# Altium schematic sheet 1_Airframe-Power_1.SchDoc
size A4; SheetNumber: 1; SheetTotal: 2; SPICEModelCacheFLVJDJZP: <root> / <DocumentId>FLVJDJZP</DocumentId> / </root>
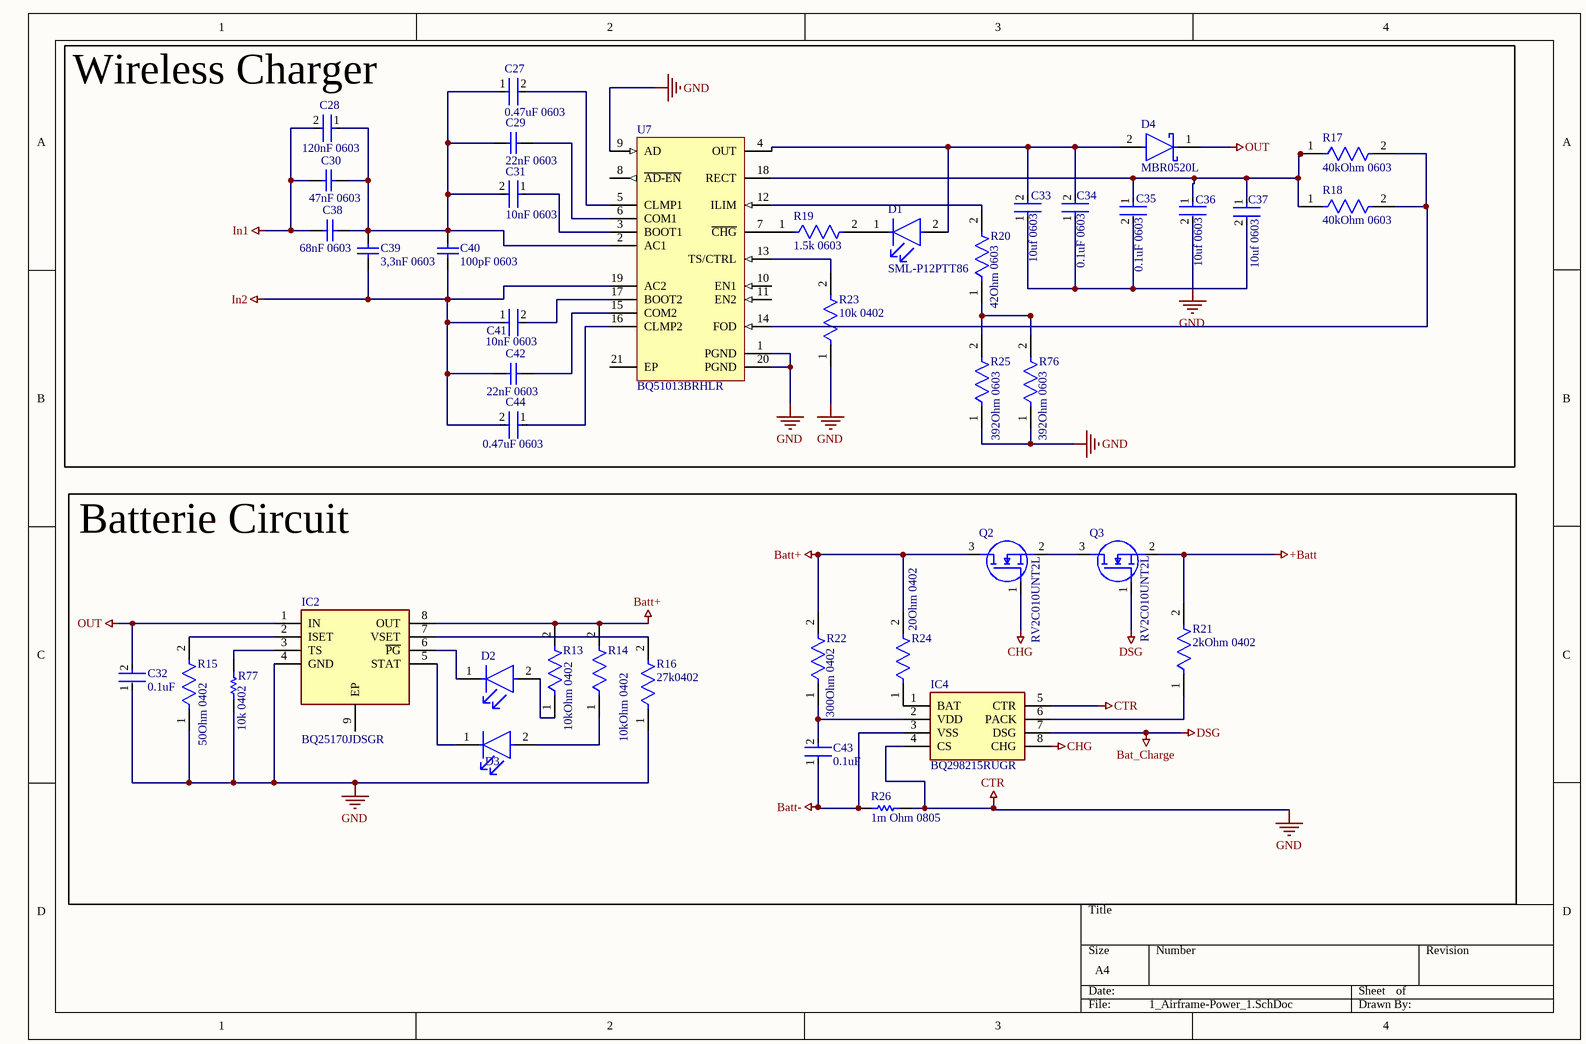
[diagram p0: 1_Airframe-Power_1.SchDoc]

## Parts
C27  0.47uF 0603  [FP-GRM188-0_1-e0_2_0_5-IPC_A]
C28  120nF 0603  [FP-C0603C-CF-MFG]
C29  22nF 0603  [CAPC1608X90X35ML10T15]
C30  47nF 0603  [CAPC1608X90X35ML10T15]
C31  10nF 0603  [FP-CC0603-DA-MFG]
C32  0.1uF  [FP-GRM15-MFG]
C33  10uf 0603  [FP-GRM188-0_1-e0_2_0_55-IPC_C]
C34  0.1uF 0603  [FP-C0603C-CF-MFG]
C35  0.1uF 0603  [FP-C0603C-CF-MFG]
C36  10uf 0603  [FP-GRM188-0_1-e0_2_0_55-IPC_C]
C37  10uf 0603  [FP-GRM188-0_1-e0_2_0_55-IPC_C]
C38  68nF 0603  [CAPC1608X90X35LL10T15]
C39  3,3nF 0603  [CAPC1608X90X35LL10T15]
C40  100pF 0603  [CAPC1608X90X35NL10T15]
C41  10nF 0603  [FP-CC0603-DA-MFG]
C42  22nF 0603  [CAPC1608X90X35ML10T15]
C43  0.1uF  [FP-GRM15-MFG]
C44  0.47uF 0603  [FP-GRM188-0_1-e0_2_0_5-IPC_A]
D1  SML-P12PTT86  [FP-SML-P1-MFG]
D2  SML-P12PTT86  [FP-SML-P1-MFG]  (value not drawn)
D3  SML-P12PTT86  [FP-SML-P1-MFG]  (value not drawn)
D4  MBR0520L  [FP-MA02A-MFG]
IC2  BQ25170JDSGR  [SON50P200X200X80-9N]
IC4  BQ298215RUGR  [BQ298215RUGR]
Q2  RV2C010UNT2L  [RV2C010UNT2L]
Q3  RV2C010UNT2L  [RV2C010UNT2L]
R13  10kOhm 0402  [FP-CRCW0402-e3-IPC_C]
R14  10kOhm 0402  [FP-CRCW0402-e3-IPC_C]
R15  50Ohm 0402  [FP-CRCW0402-e3-IPC_C]
R16  27k0402  [FP-CRCW0402-e3-IPC_C]
R17  40kOhm 0603  [FP-CRCW0402-e3-IPC_C]
R18  40kOhm 0603  [FP-CRCW0402-e3-IPC_C]
R19  1.5k 0603  [FP-CRCW0402-e3-IPC_C]
R20  42Ohm 0603  [FP-CRCW0402-e3-IPC_C]
R21  2kOhm 0402  [FP-CRCW0402-e3-IPC_C]
R22  300Ohm 0402  [FP-CRCW0402-e3-IPC_C]
R23  10k 0402  [FP-CRCW0402-e3-IPC_B]
R24  20Ohm 0402  [FP-CRCW0402-e3-IPC_C]
R25  392Ohm 0603  [FP-CRCW0402-e3-IPC_C]
R26  1m Ohm 0805  [RESC1609X50X30LL10T20]
R76  392Ohm 0603  [FP-CRCW0402-e3-IPC_C]
R77  10k 0402  [RESC1608X55X25ML10T15]
U7  BQ51013BRHLR  [RHL0020A_V]

## Blocks framed on the sheet
Wireless Charger: C27-C31 C33-C42 C44 D1 D4 R17-R20 R23 R25 R76 U7
Batterie Circuit: C32 C43 D2 D3 IC2 IC4 Q2 Q3 R13-R16 R21 R22 R24 R26 R77

## Nets
+Batt: Q3.2(S) R21.2
Bat_Charge: IC4.7(DSG) Q3.1(G)  [also labelled DSG]
Batt+: IC2.8(OUT) Q2.3(D) R13.2 R14.2 R22.2 R24.2
Batt-: C43.1 IC4.3(VSS) R26.1
CHG: IC4.8(CHG) Q2.1(G)
CTR: C32.1 C36.2 IC2.4(GND) IC4.4(CS) IC4.5(CTR) R15.1 R16.1 R23.1 R25.1 R26.2 R76.1 R77.2 U7.1(PGND) U7.9(AD) U7.20(PGND)  [also labelled GND]
In1: C28.2 C30.1 C38.1
In2: C39.1 C40.1 C41.1 C42.2 C44.2 U7.19(AC2)
OUT: C32.2 D4.1(C) IC2.1(IN)
NetC27_1: C27.1 C28.1 C29.1 C30.2 C31.2 C38.2 C39.2 C40.2 U7.2(AC1)
NetC27_2: C27.2 U7.5(CLMP1)
NetC29_2: C29.2 U7.6(COM1)
NetC31_1: C31.1 U7.3(BOOT1)
NetC33_1: C33.1 C34.1 C35.2 C37.2
NetC33_2: C33.2 C34.2 D1.2(A) D4.2(A) U7.4(OUT)
NetC35_1: C35.1 C36.1 C37.1 R17.1 R18.1 U7.18(RECT)
NetC41_2: C41.2 U7.17(BOOT2)
NetC42_1: C42.1 U7.15(COM2)
NetC43_2: C43.2 IC4.2(VDD) R22.1
NetC44_1: C44.1 U7.16(CLMP2)
NetD1_1: D1.1(C) R19.2
NetD2_1: D2.1(C) IC2.6(~{PG})
NetD2_2: D2.2(A) R13.1
NetD3_1: D3.1(C) IC2.5(STAT)
NetD3_2: D3.2(A) R14.1
NetIC2_2: IC2.2(ISET) R15.2
NetIC2_3: IC2.3(TS) R77.1
NetIC2_7: IC2.7(VSET) R16.2
NetIC4_1: IC4.1(BAT) R24.1
NetIC4_6: IC4.6(PACK) R21.1
NetQ2_2: Q2.2(S) Q3.3(D)
NetR17_2: R17.2 R18.2 U7.14(FOD)
NetR19_1: R19.1 U7.7(~{CHG})
NetR20_1: R20.1 R25.2 R76.2
NetR20_2: R20.2 U7.12(ILIM)
NetR23_2: R23.2 U7.13(TS/CTRL)

Not connected (* = marked no-connect by the designer): IC2 9(EP); U7 8(~{AD-EN}) 10(EN1) 11(EN2) 21(EP)

## Library data of the parts
C27 C44 = CMP-2006-02860-2: Chip Multilayer Ceramic Capacitors for General Purpose, 0603, 0.47uF, X7R, 15%, 10%, 16V; Capacitance: 470nF; Material: Ceramic; Termination: SMD/SMT; Case Code (Imperial): 0603; Height: 0.8mm; Dielectric: X7R; Length: 1.6mm; Packaging: Tape and Reel; Mount: Surface Mount; Thickness: 0.035inch; Voltage Rating (DC): 16V; Case Code (Metric): 1608; REACH SVHC: No SVHC; Depth: 0.8mm; Number of Pins: 2; Max Operating Temperature: 125°C; Min Operating Temperature: -55°C; Width: 0.8mm; Voltage: 16V; Lead Free: Lead Free; Voltage Rating: 16V; Package Quantity: 1; Case/Package: 0603; Tolerance: 10%
C28 = CMP-1035-02605-3: 0603 C 120nF Ceramic Multilayer Capacitor; 50 V; +125degC; X7R Dielec; +/-10%; Manufacturer: KEMET; Manufacturer Part Number: C0603C124K5RACTU; Capacitance: 0.12 μF; Automotive Grade: Grade 1; Voltage Rating: 50 V; Tolerance: 0.1; Temperature Coefficient: 30ppm/°C; Value: 0.12 μF; Device Class L2: Capacitors; Package: C0603C-CF; Digikey Description: 0603 C 120nF Ceramic Multilayer Capacitor; 50 V; +125degC; X7R Dielec; +/-10%; Device Class L3: Ceramic Capacitors; Category: Cap; Material: Ceramic; Height: 0.87mm; Temperature: -55°C to +125°C; Temperature Range High: +125°C; Temperature Characteristic: X7R; Lead Free: Yes; Automotive: Yes; ComponentLink2URL: https://api.kemet.com/component-edge/download/datasheet/C0603C100J5GACAUTO.pdf; Octopart: https://octopart.com/c0603c124k5ractu-kemet-12818104; Device Class L1: Passive Components; RoHS: TRUE; ComponentLink2Description: Datasheet; Temperature Range Low: -55°C
C29 C42 = CMP-2006-02910-1: Manufacturer: Murata; Part Number: GRM188R71H223KA01D
C30 = CMP-2006-02927-1: Manufacturer: Murata; Part Number: GRM188R71H473KA61D
C31 C41 = CMP-2100-03600-2: CAP CER 10000PF 50V X7R 0603; Manufacturer Part Number: CC0603KRX7R9BB103; Manufacturer: YAGEO; Tolerance: 0.1; Material: Ceramic; Temperature Coefficient: 15%; Mouser Description: Multilayer Ceramic Capacitor, CC Series, 0.01 - F, - 10%, X7R, 50 V, 0603 [1608 Metric]; Digikey Description: CAP CER 10000PF 50V X7R 0603; Height: 0.9mm; Category: Cap; Temperature Characteristic: X7R; Footprint Url: http://www.yageo.com/exep/pages/download/literatures/UPY-C_GEN_24.pdf; Lead Free: Yes; Voltage Rating: 50 V; Temperature: -55°C to +125°C; Device Class L3: Ceramic Capacitors; ComponentLink2Description: Datasheet; Voltage: 50 V; Package: CC0603-DA; Octopart: https://octopart.com/cc0603krx7r9bb103-yageo-192938; Automotive: No; Temperature Range High: +125°C; Temperature Range Low: -55°C; Value: 10 nF; RoHS: TRUE; Device Class L1: Passive Components; ComponentLink2URL: http://www.yageo.com/documents/recent/UPY-GPHC_X7R_6.3V-to-50V_18.pdf; Device Class L2: Capacitors; Capacitance: 10 nF
C32 C43 = CMP-2100-03641-2: CAP CER 0.1UF 16V X7R 0402; Manufacturer Part Number: GRM155R71C104KA88D; Manufacturer: Murata; Standoff Height: 0mm; Tolerance: 10%; Voltage Rating: 16Vdc; Material: Ceramic; Capacitance: 0.10μF; Value: 0.10μF; RoHS: TRUE; Temperature Characteristic: X7R; Octopart: https://octopart.com/grm155r71c104ka88d-murata-196880; Digikey Description: CAP CER 0.1UF 16V X7R 0402; Device Class L3: Ceramic Capacitors; Height: 0.55mm; ComponentLink2Description: Datasheet; Temperature Range Low: -55°C; Ipc Land Pattern Name: CAPC10050X219; ComponentLink2URL: https://search.murata.co.jp/Ceramy/image/img/A01X/G101/ENG/GRM155R71H471KA01-01A.pdf; Device Class L1: Passive Components; Lead Free: yes; Category: Cap; Package: GRM15; Temperature: -55°C to +125°C; Device Class L2: Capacitors; Temperature Range High: +125°C; Mouser Description: 0402 0.1 uF 16V ±10 % Tolerance X7R SMT Multilayer Ceramic Capacitor
C33 C36 C37 = CMP-2006-02792-2: Chip Multilayer Ceramic Capacitors for General Purpose, 0603, 10uF, X5R, 15%, 20%, 6.3V; Packaging: Tape and Reel; Voltage Rating (DC): 6.3V; Width: 0.031inch; Termination: SMD/SMT; Dielectric: X5R; Package Quantity: 4000; Voltage Rating: 6.3V; Capacitance: 10uF; Case/Package: 0603; Min Operating Temperature: -55°C; Voltage: 6.3V; Length: 1.6mm; Thickness: 0.035inch; Lead Free: Lead Free; Depth: 0.8mm; Case Code (Imperial): 0603; Max Operating Temperature: 85°C; Material: Ceramic; Height: 0.8mm; Tolerance: 20%; Mount: Surface Mount; REACH SVHC: No SVHC; Radiation Hardening: No; Case Code (Metric): 1608
C34 C35 = CMP-2006-03061-2: CAP CER 0.1UF 50V X7R 0603; Manufacturer: KEMET; Manufacturer Part Number: C0603C104K5RACTU; Tolerance: 0.1; Temperature Coefficient: 30ppm/°C; Material: Ceramic; Automotive Grade: Grade 1; Value: 0.10 μF; Temperature: -55°C to +125°C; RoHS: TRUE; Temperature Range High: +125°C; Lead Free: Yes; Octopart: https://octopart.com/c0603c104k5ractu-kemet-139244; Digikey Description: CAP CER 0.1UF 50V X7R 0603; Category: Cap; Package: C0603C-CF; ComponentLink2Description: Datasheet; Temperature Range Low: -55°C; Device Class L1: Passive Components; Voltage Rating: 50 V; Automotive: Yes; Device Class L3: Ceramic Capacitors; ComponentLink2URL: https://api.kemet.com/component-edge/download/datasheet/C0603C100J5GACAUTO.pdf; Capacitance: 0.10 μF; Device Class L2: Capacitors; Temperature Characteristic: X7R; Height: 0.87mm
C38 = CMP-2006-02937-1: Part Number: GRM188R71H683KA93D; Manufacturer: Murata
C39 = CMP-2006-02916-1: Manufacturer: Murata; Part Number: GRM188R71H332KA01D
C40 = CMP-2006-02595-1: Part Number: GRM1885C1H101JA01D; Manufacturer: Murata
D1-D3 = CMP-08952-000020-1: LED GREEN CLEAR 1006 SMD; Manufacturer: Rohm; Led Orientation: Top View; Wavelength: 560nm; Forward Current: 20mA; Reverse Voltage: 5V; Power Dissipation: 52mW; Forward Voltage: 2.1V; Luminous Intensity: 10mcd; Device Class L1: Optoelectronics; Digikey Description: LED GREEN CLEAR 1006 SMD; Lead Free: Yes; Manufacturer Part Number: SML-P12PTT86; Temperature Range High: +85°C; Octopart: https://octopart.com/sml-p12ptt86-rohm-9290705; Device Class L2: LEDs; Colour: Green; RoHS: TRUE; Height: 0.25mm; Automotive: No; Device Class L3: unset; Temperature Range Low: -40°C; ComponentLink2Description: Datasheet; Mouser Description: Standard LEDs - SMD SMD Green 13 mcd height=0.2; Category: Diode; ComponentLink2URL: https://www.rohm.com/datasheet/SML-P12DT(R); Temperature: -40°C to +85°C; Package: SML-P1
D4 = CMP-2000-04926-2: DIODE SCHOTTKY 20V 500MA SOD123; Current Rating: 500A; Peak Non-Repetitive Surge Current: 5.5A; Peak Reverse Current: 250uA; Power Dissipation: 400mW; Polarity: Standard; Element Configuration: Single; Capacitance: 4pF; Forward Voltage: 385mV; Voltage Rating (DC): 20V; Max Reverse Voltage (DC): 20V; Packaging: Tape and Reel; Min Operating Temperature: -65°C; Max Repetitive Reverse Voltage (Vrrm): 20V; Forward Current: 500mA; Max Operating Temperature: 125°C; Width: 1.6mm; Height: 1.03mm; Max Forward Surge Current (Ifsm): 5.5A; Mount: Surface Mount; Max Reverse Leakage Current: 250uA; Weight: 0.03g; Package Quantity: 3000; Max Surge Current: 5.5A; Radiation Hardening: No; REACH SVHC: No SVHC; Average Rectified Current: 500mA; Output Current: 500mA; Length: 2.7mm; Number of Pins: 2; Lead Free: Lead Free
IC2 = BQ25170JDSGR: Integrated Circuit; Manufacturer_Name: Texas Instruments; Datasheet Link: https://www.ti.com/lit/ds/symlink/bq25170j.pdf?ts=1649696800811&ref_url=https%253A%252F%252Fwww.ti.com%252Fproduct%252FBQ25170J; Height: 0.8mm; Manufacturer_Part_Number: BQ25170JDSGR; Mouser Part Number: 595-BQ25170JDSGR; Mouser Price/Stock: https://www.mouser.co.uk/ProductDetail/Texas-Instruments/BQ25170JDSGR?qs=A6eO%252BMLsxmRHugWPcRNj7A%3D%3D; Arrow Part Number: BQ25170JDSGR; Arrow Price/Stock: https://www.arrow.com/en/products/bq25170jdsgr/texas-instruments?region=nac
IC4 = BQ298215RUGR: Integrated Circuit; Manufacturer_Name: Texas Instruments; Datasheet Link: https://www.arrow.com/en/products/bq298215rugr/texas-instruments?region=nac; Height: 0.4mm; Manufacturer_Part_Number: BQ298215RUGR; Mouser Part Number: 595-BQ298215RUGR; Mouser Price/Stock: https://www.mouser.co.uk/ProductDetail/Texas-Instruments/BQ298215RUGR?qs=iLbezkQI%252Bsg5V9tasAPYiQ%3D%3D; Arrow Part Number: BQ298215RUGR; Arrow Price/Stock: https://www.arrow.com/en/products/bq298215rugr/texas-instruments?region=nac
Q2 Q3 = RV2C010UNT2L: MOSFET (N-Channel); Manufacturer_Name: ROHM Semiconductor; Datasheet Link: https://datasheet.datasheetarchive.com/originals/distributors/DKDS-18/357047.pdf; Height: 0.4mm; Manufacturer_Part_Number: RV2C010UNT2L; Mouser Part Number: 755-RV2C010UNT2L; Mouser Price/Stock: https://www.mouser.co.uk/ProductDetail/ROHM-Semiconductor/RV2C010UNT2L?qs=npTsUczJOtPdY4l8qoqhcQ%3D%3D
R13 R14 R21 R22 R24 = CMP-2002-08359-2: Resistance: 20R; Voltage Rating: 50V; Max Power Dissipation: 63mW; Temperature Coefficient: 100ppm/°C; Tolerance: 1%; Mount: Surface Mount; Packaging: Tape and Reel; Military Standard: Not; Height: 0.35mm; Depth: 0.5mm; Lead Free: Lead Free; Number of Terminations: 2; Contact Plating: Tin; Max Operating Temperature: 155°C; Package Quantity: 10; Termination: SMD/SMT; Min Operating Temperature: -55°C; Features: Automotive AEC-Q200; Radiation Hardening: No; Case Code (Metric): 1005; Width: 0.02inch; Composition: Thick Film; Case/Package: 0402; Case Code (Imperial): 0402; Power Rating: 63mW; Voltage Rating (DC): 50V; Length: 1mm; Weight: 2.3E-05oz
R15 = CMP-2002-08359-2: 600Ohm 0402; Resistance: 20R; Voltage Rating: 50V; Max Power Dissipation: 63mW; Temperature Coefficient: 100ppm/°C; Tolerance: 1%; Mount: Surface Mount; Packaging: Tape and Reel; Military Standard: Not; Height: 0.35mm; Depth: 0.5mm; Lead Free: Lead Free; Number of Terminations: 2; Contact Plating: Tin; Max Operating Temperature: 155°C; Package Quantity: 10; Termination: SMD/SMT; Min Operating Temperature: -55°C; Features: Automotive AEC-Q200; Radiation Hardening: No; Case Code (Metric): 1005; Width: 0.02inch; Composition: Thick Film; Case/Package: 0402; Case Code (Imperial): 0402; Power Rating: 63mW; Voltage Rating (DC): 50V; Length: 1mm; Weight: 2.3E-05oz
R16 = CMP-2002-08359-2: 27kOhm 0402; Resistance: 20R; Voltage Rating: 50V; Max Power Dissipation: 63mW; Temperature Coefficient: 100ppm/°C; Tolerance: 1%; Mount: Surface Mount; Packaging: Tape and Reel; Military Standard: Not; Height: 0.35mm; Depth: 0.5mm; Lead Free: Lead Free; Number of Terminations: 2; Contact Plating: Tin; Max Operating Temperature: 155°C; Package Quantity: 10; Termination: SMD/SMT; Min Operating Temperature: -55°C; Features: Automotive AEC-Q200; Radiation Hardening: No; Case Code (Metric): 1005; Width: 0.02inch; Composition: Thick Film; Case/Package: 0402; Case Code (Imperial): 0402; Power Rating: 63mW; Voltage Rating (DC): 50V; Length: 1mm; Weight: 2.3E-05oz
R17 R18 = CMP-2002-08122-2: 392Ohm 0603; Tolerance: 5%; Max Power Dissipation: 63mW; Voltage Rating: 50V; Temperature Coefficient: 100ppm/°C; Resistance: 0mR; Contact Plating: Tin; Height: 0.35mm; Radiation Hardening: No; Features: Automotive AEC-Q200; Composition: Thick Film; Width: 0.5mm; Weight: 2.3E-05oz; Termination: SMD/SMT; Packaging: Tape and Reel; Mount: Surface Mount; Case Code (Metric): 1005; Military Standard: Not; Min Operating Temperature: -55°C; Number of Terminations: 2; Package Quantity: 1; Case Code (Imperial): 0402; Depth: 0.5mm; Max Operating Temperature: 155°C; Case/Package: 0402; Power Rating: 63mW; Lead Free: Lead Free; Voltage Rating (DC): 50V; Length: 1mm
R19 R20 R25 R76 = CMP-2002-08122-2: Tolerance: 5%; Max Power Dissipation: 63mW; Voltage Rating: 50V; Temperature Coefficient: 100ppm/°C; Resistance: 0mR; Contact Plating: Tin; Height: 0.35mm; Radiation Hardening: No; Features: Automotive AEC-Q200; Composition: Thick Film; Width: 0.5mm; Weight: 2.3E-05oz; Termination: SMD/SMT; Packaging: Tape and Reel; Mount: Surface Mount; Case Code (Metric): 1005; Military Standard: Not; Min Operating Temperature: -55°C; Number of Terminations: 2; Package Quantity: 1; Case Code (Imperial): 0402; Depth: 0.5mm; Max Operating Temperature: 155°C; Case/Package: 0402; Power Rating: 63mW; Lead Free: Lead Free; Voltage Rating (DC): 50V; Length: 1mm
R23 = CMP-2002-08135-2: Power Rating: 63mW; Resistance: 10kR; Tolerance: 1%; Voltage Rating: 50V; Temperature Coefficient: 100ppm/°C; Case Code (Metric): 1005; Features: Automotive AEC-Q200; Termination: SMD/SMT; Mount: Surface Mount; Package Quantity: 10; Packaging: Tape and Reel; Case Code (Imperial): 0402; Weight: 2.3E-05oz; Lead Free: Lead Free; Width: 0.02inch; Max Power Dissipation: 63mW; Number of Terminations: 2; Height: 0.35mm; Number of Pins: 2; Composition: Thick Film; Length: 1mm; Voltage Rating (DC): 50V; Case/Package: 0402; Radiation Hardening: No; Contact Plating: Tin; Depth: 0.5mm; Military Standard: Not; Min Operating Temperature: -55°C; Max Operating Temperature: 155°C
R26 = CMP-1012-00171-2: Manufacturer: Vishay Dale; Part Number: CRCW06031R00FKEA
R77 = CMP-2100-03667-1: Manufacturer: Yageo; Temperature Coefficient: 200ppm/degreesC; Tolerance: 5%; Voltage Rating: 50V; Power Rating: 100mW; Resistance: 0mOhm; Width: 0.8mm; Max Operating Temperature: 155degC; Package Reference: 0603; Height: 0.45mm; Depth: 0.8mm; Package Description: 2-Pin Surface Mount Device, Body 1.6 x 0.8 mm; Termination: SMD/SMT; Package Quantity: 5000; Case/Package: 0603; Case Code (Imperial): 0603; Radiation Hardening: No; Number of Pins: 2; Length: 1.6mm; Lead Free: LeadFree; Voltage Rating (DC): 50V; Military Standard: Not; Datasheet URL: http://www.yageo.com/NewPortal/yageodocoutput?fileName=/pdf/R-Chip/PYu-RC_Group_51_RoHS_L_5.pdf; Manufacturer URL: http://www.yageo.com/; Packaging: TapeandReel; Case Code (Metric): 1608; Min Operating Temperature: -55degC; Composition: ThickFilm; RoHSCompliant: true; Contact Plating: Tin; Datasheet Version: Rev. 5, 10/2016; REACH SVHC: NoSVHC
U7 = CMP-0393-00004-2: WPC 1.1 Compatible Fully Integrated Wireless Power Receiver IC, 4 V Min Input, 20-pin VQFN (RHL), Green (RoHS & no Sb/Br); Eco-Plan: TRUE; Vin(Min)(V): 4; PartNumber: BQ51013B; DatasheetVersion: SLUSB62; ComponentLink1Description: Manufacturer URL; ComponentLink1URL: http://www.ti.com/; ComponentLink3URL: http://www.ti.com/lit/ds/symlink/bq51051b.pdf; Mounting Technology: Surface Mount; ComponentLink2Description: Datasheet; ComponentLink2URL: http://www.ti.com/lit/ds/symlink/bq51013b.pdf; PackageReference: RHL0020A; PackageVersion: 4205346-3/J, 12/2011; PackageDescription: 20-Pin Plastic Flat Pack, Body 4.5 x 3.5 mm, Pitch 0.5 mm; ComponentLink3Description: Package Specification